# EAGLE design DMX_isolated_V2_single-sided (EAGLE 6.4)
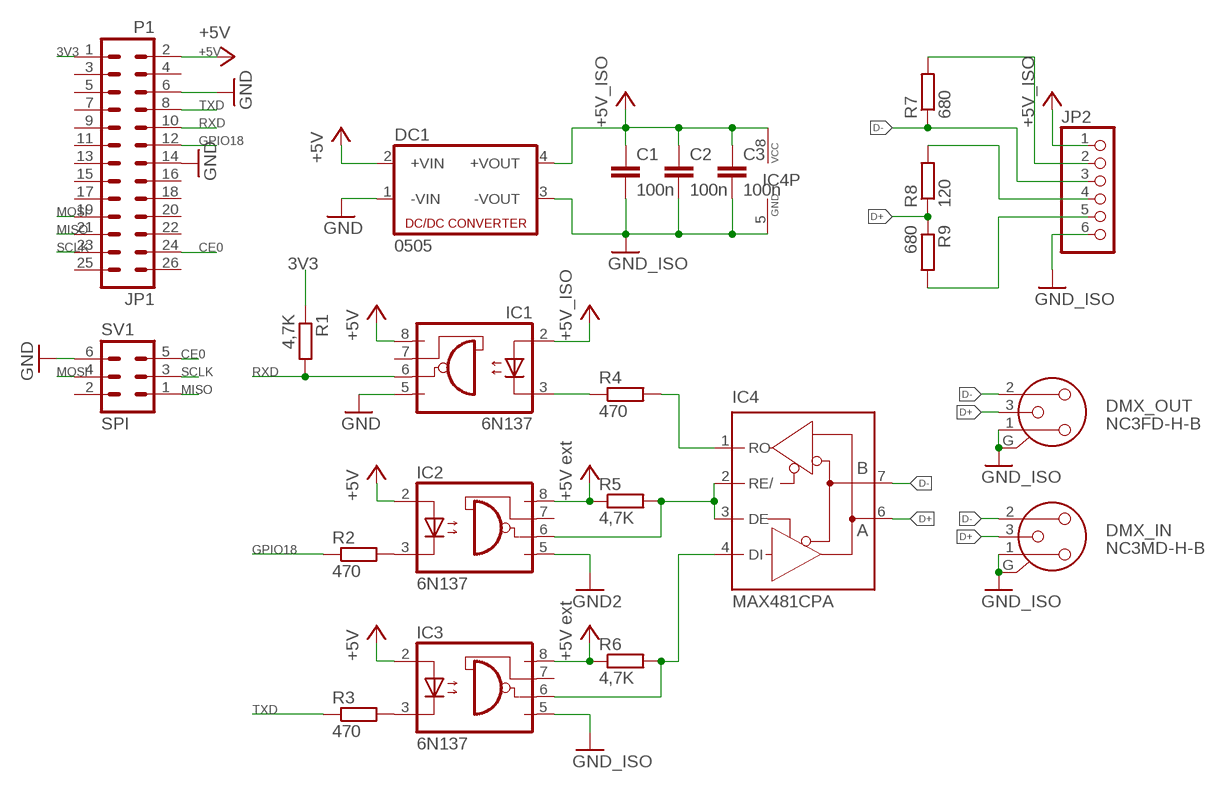
[diagram p0: schematic, sheet 1]

## Parts
C1  100n  C-EU050-024X044  [C050-024X044]
C2  100n  C-EU050-024X044  [C050-024X044]
C3  100n  C-EU050-024X044  [C050-024X044]
DC1  0505  NME  [NME]
DMX_IN  NC3MD-H-B  [NC3MD-H-B]
DMX_OUT  NC3FD-H-B  [NC3FD-H-B]
IC1  6N137  [DIL08]
IC2  6N137  [DIL08]
IC3  6N137  [DIL08]
IC4  MAX481CPA  [DIL08]
JP1  P1  MA13-2  [MA13-2]
JP2  PINHD-1X6  [1X06]
R1  4,7K  R-EU_0204/2V  [0204V]
R2  470  R-EU_0204/2V  [0204V]
R3  470  R-EU_0204/2V  [0204V]
R4  470  R-EU_0204/2V  [0204V]
R5  4,7K  R-EU_0204/2V  [0204V]
R6  4,7K  R-EU_0204/2V  [0204V]
R7  680  R-EU_0204/2V  [0204V]
R8  120  R-EU_0204/2V  [0204V]
R9  680  R-EU_0204/2V  [0204V]
SV1  SPI  MA03-2  [MA03-2]

## Nets
3V3: JP1.1 R1.1
+5V: DC1.2(+VIN) IC1.8(VCC) IC2.2(A) IC3.2(A) JP1.2
+5V_ISO: C1.1 C2.1 C3.1 DC1.4(+VOUT) IC1.2(A) IC2.8(VCC) IC3.8(VCC) IC4.8(VCC) JP2.1 R5.1 R6.1 ; supply symbol labelled +5V ext
CE0: JP1.24 SV1.5
D+: DMX_IN.3 DMX_OUT.3 IC4.6(A) R8.1 R9.1
D-: DMX_IN.2 DMX_OUT.2 IC4.7(B) JP2.3 R7.1
GND: DC1.1(-VIN) IC1.5(GND) JP1.6 JP1.14 SV1.6
GND_ISO: C1.2 C2.2 C3.2 DC1.3(-VOUT) DMX_IN.1 DMX_IN.G DMX_OUT.1 DMX_OUT.G IC2.5(GND) IC3.5(GND) IC4.5(GND) JP2.6 ; supply symbol labelled GND2
GPIO18: JP1.12 R2.1
MISO: JP1.21 SV1.1
MOSI: JP1.19 SV1.4
N$2: JP2.5 R9.2
N$3: IC2.3(C) R2.2
N$4: IC2.6(VO) IC4.2(RE/) IC4.3(DE) R5.2
N$5: IC3.3(C) R3.2
N$7: IC3.6(VO) IC4.4(DI) R6.2
N$8: IC1.3(C) R4.1
N$9: IC4.1(RO) R4.2
N$10: JP2.4 R8.2
N$12: JP2.2 R7.2
RXD: IC1.6(VO) JP1.10 R1.2
SCLK: JP1.23 SV1.3
TXD: JP1.8 R3.1
Unconnected: IC1.7(VE) IC2.7(VE) IC3.7(VE) JP1.3 JP1.4 JP1.5 JP1.7 JP1.9 JP1.11 JP1.13 JP1.15 JP1.16 JP1.17 JP1.18 JP1.20 JP1.22 JP1.25 JP1.26 SV1.2

## Library data of the parts
C1-C3 = rcl:C-EU: CAPACITOR, European symbol
DC1 = dc-dc-converter:NME: DC-DC CONVERTER; MF: C & D TECHNOLOGIES, INC; MPN: NME1205D; OC_FARNELL: 1021466; OC_NEWARK: 98B8198
DMX_IN = con-neutrik_ag:NC3: Neutrik Audio Connector XLR SERIES Stereo 1/4" jack Source: www.neutrik.com/; MPN: NC3MD-H-B; OC_FARNELL: unknown; OC_NEWARK: 27B4298
DMX_OUT = con-neutrik_ag:NC3: Neutrik Audio Connector XLR SERIES Stereo 1/4" jack Source: www.neutrik.com/; MPN: NC3FD-H-B; OC_FARNELL: unknown; OC_NEWARK: 27B4248
IC1-IC3 = optocoupler:6N137: MOTOROLA OPTO COUPLER; MPN: 6N137; OC_FARNELL: 1328376; OC_NEWARK: 52M1895
IC4 = maxim:MAX481CPA: RS485 TRANSEIVER; MPN: MAX481CPA+; OC_FARNELL: unknown; OC_NEWARK: 99K3445
JP1 = con-lstb:MA13-2: PIN HEADER; OC_FARNELL: unknown; OC_NEWARK: unknown
JP2 = pinhead:PINHD-1X6: PIN HEADER
R1-R9 = resistor:R-EU_: RESISTOR, European symbol
SV1 = con-lstb:MA03-2: PIN HEADER; OC_FARNELL: unknown; OC_NEWARK: unknown

## Net classes
1 power: width 0.508 mm

## Board
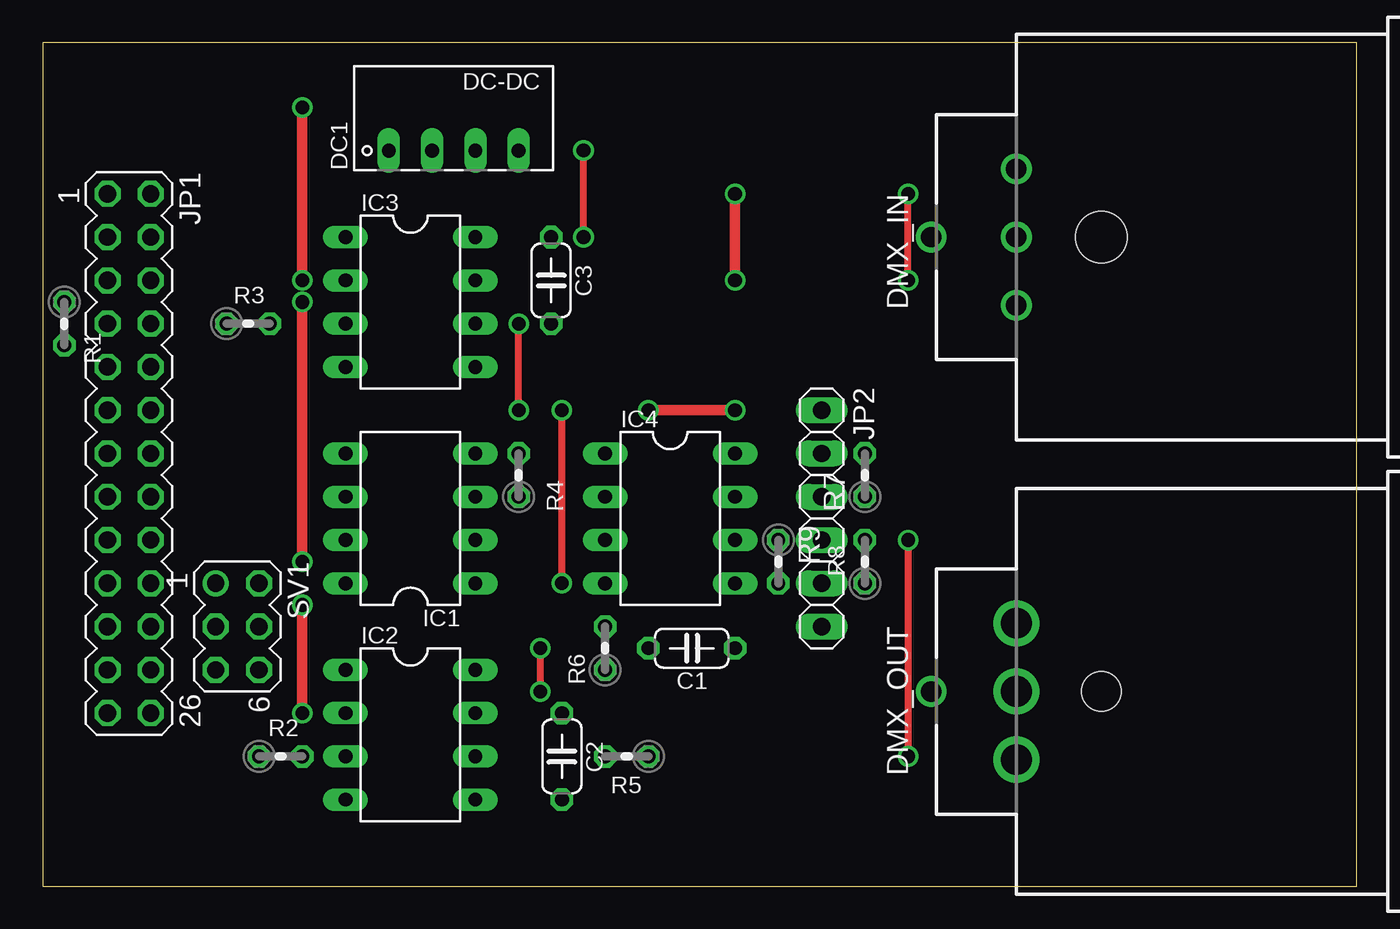
[diagram p1: board, top side]
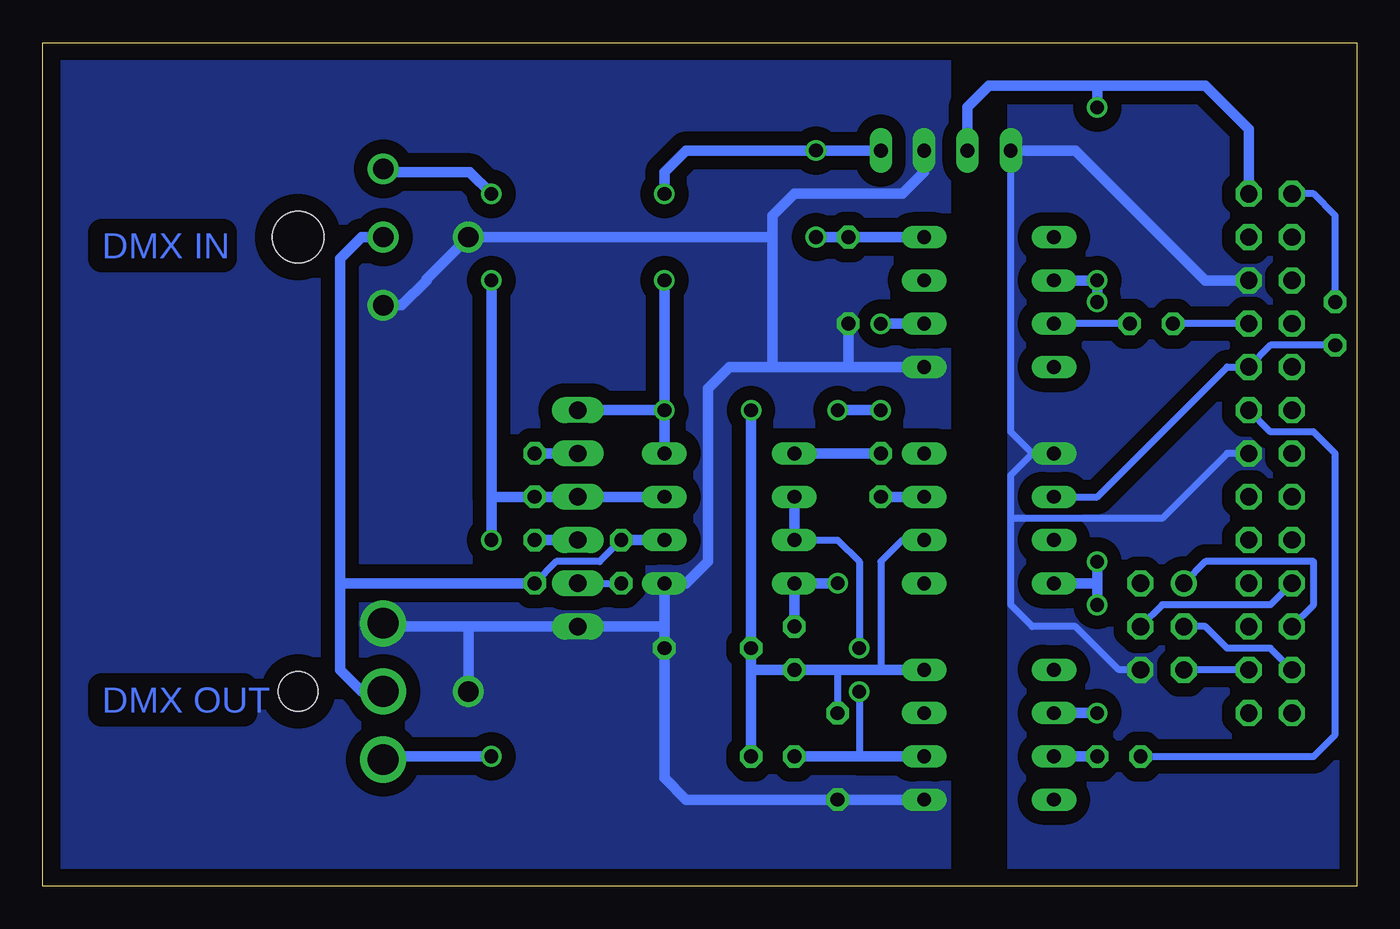
[diagram p2: board, bottom side, seen from below]

Size 77.14 x 49.52 mm. Coordinates in mm from the lower left corner, seen from the top.
Outline: 0,0 77.14,0 77.14,49.52 0,49.52 0,0
Copper layers (1*16): Top 0.035mm / dielectric 1.5mm / Bottom 0.035mm
Design rules "default": minimum track width 10mil, minimum drill 24mil, track to track 8mil, track to pad 8mil, pad to pad 8mil, via to via 8mil, smd to smd 8mil, copper to edge 40mil, drill to drill 8mil, minimum pad ring 10mil, minimum via ring 8mil, stop-mask expansion 4mil, vias tented up to drill 0mil, thermal gap 10mil

### Footprints (pad centres in the part's own frame; a part is rotated, then mirrored left to right if it is on the bottom)
C050-024X044 = drill 0.813 octagon: 1 -2.54,0; 2 2.54,0
NME = drill 0.813 long: 1 0,3.81; 2 0,1.27; 3 0,-1.27; 4 0,-3.81
NC3MD-H-B = drill 1.2: 1 4,0; 2 -4,0; 3 0,0; G 0,-5 | hole 3: 0,5
NC3FD-H-B = drill 1.8: 1 -4,0; 2 4,0; 3 0,0 | drill 1.2: G 0,-5 | hole 2.3: 0,5
DIL08 = drill 0.813 long: 1 -3.81,-3.81; 2 -1.27,-3.81; 3 1.27,-3.81; 4 3.81,-3.81; 5 3.81,3.81; 6 1.27,3.81; 7 -1.27,3.81; 8 -3.81,3.81
MA13-2 = drill 1.016 octagon: 1 -15.24,-1.27; 2 -15.24,1.27; 3 -12.7,-1.27; 4 -12.7,1.27; 5 -10.16,-1.27; 6 -10.16,1.27; 7 -7.62,-1.27; 8 -7.62,1.27; 9 -5.08,-1.27; 10 -5.08,1.27; 11 -2.54,-1.27; 12 -2.54,1.27; 13 0,-1.27; 14 0,1.27; 15 2.54,-1.27; 16 2.54,1.27; 17 5.08,-1.27; 18 5.08,1.27; 19 7.62,-1.27; 20 7.62,1.27; 21 10.16,-1.27; 22 10.16,1.27; 23 12.7,-1.27; 24 12.7,1.27; 25 15.24,-1.27; 26 15.24,1.27
1X06 = drill 1.016 long: 1 -6.35,0; 2 -3.81,0; 3 -1.27,0; 4 1.27,0; 5 3.81,0; 6 6.35,0
0204V = drill 0.813 octagon: 1 -1.27,0; 2 1.27,0
MA03-2 = drill 1.016: 1 -2.54,-1.27 | drill 1.016 octagon: 2 -2.54,1.27; 3 0,-1.27; 4 0,1.27; 5 2.54,-1.27; 6 2.54,1.27

### Placement (x,y rotation side)
C1  38.1,13.97 0 top
C2  30.48,7.62 270 top
C3  29.84,35.56 270 top
DC1  24.13,43.18 90 top
DMX_IN  57.15,38.1 270 top
DMX_OUT  57.15,11.43 270 top
IC1  21.59,21.59 90 top
IC2  21.59,8.89 270 top
IC3  21.59,34.29 270 top
IC4  36.83,21.59 270 top
JP1  5.08,25.4 270 top
JP2  45.72,21.59 270 top
R1  1.27,33.02 270 top
R2  13.97,7.62 0 top
R3  12.07,33.02 0 top
R4  27.94,24.13 90 top
R5  34.29,7.62 180 top
R6  33.02,13.97 90 top
R7  48.26,24.13 90 top
R8  48.26,19.05 90 top
R9  43.18,19.05 270 top
SV1  11.43,15.24 270 top

### Tracks (layer width: path | path; a pad name or v marks a point on that pad's centre or on a via)
3V3
  Bottom 0.406: R1.1 1.27,39.37 2.54,40.64 JP1.1
+5V  (via drill 0.8)
  Top 0.61: v15.24,35.56 v15.24,45.72 | v15.24,34.29 v15.24,19.05 | v15.24,16.51 v15.24,10.16
  Bottom 0.61: JP1.2 6.35,44.45 8.89,46.99 15.24,46.99 | 15.24,46.99 21.59,46.99 22.86,45.72 DC1.2 | v15.24,45.72 15.24,46.99 | IC3.2 v15.24,35.56 v15.24,34.29 | v15.24,19.05 15.24,17.78 | IC1.8 15.24,17.78 | 15.24,17.78 v15.24,16.51 | v15.24,10.16 IC2.2
+5V_ISO  (via drill 0.8)
  Top 0.406: v31.75,38.1 v31.75,43.18
  Top 0.61: v40.64,40.64 v40.64,35.56 | v35.56,27.94 v40.64,27.94
  Bottom 0.406: 30.48,12.7 C2.1 | IC1.2 26.67,20.32 27.94,19.05 27.94,12.7
  Bottom 0.61: IC3.8 C3.1 v31.75,38.1 | v40.64,35.56 v40.64,27.94 | v40.64,27.94 IC4.8 | DC1.4 v31.75,43.18 39.37,43.18 40.64,41.91 v40.64,40.64 | IC2.8 27.94,12.7 30.48,12.7 R6.1 35.56,12.7 | R5.1 35.56,12.7 | 35.56,12.7 C1.1 v35.56,27.94 | v40.64,27.94 JP2.1
CE0
  Bottom 0.406: JP1.24 SV1.5
D+
  Bottom 0.406: DMX_OUT.3 58.42,11.43 | R9.1 44.45,19.05 46.99,19.05 R8.1
  Bottom 0.61: IC4.6 R9.1 | 59.69,17.78 59.69,12.7 58.42,11.43 | 59.69,17.78 59.69,36.83 58.42,38.1 DMX_IN.3 | R8.1 59.69,17.78
D-  (via drill 0.8)
  Top 0.406: v50.8,35.56 v50.8,40.64 | v50.8,20.32 v50.8,7.62
  Bottom 0.406: 56.96,41.91 DMX_IN.2 | 56.96,7.62 DMX_OUT.2
  Bottom 0.61: IC4.7 JP2.3 R7.1 50.8,22.86 | 50.8,22.86 v50.8,35.56 | v50.8,40.64 52.07,41.91 56.96,41.91 | 50.8,22.86 v50.8,20.32 | v50.8,7.62 56.96,7.62
GND
  Bottom 0.406: IC1.5 19.05,25.4 | 19.05,25.4 20.32,26.67 DC1.1 | SV1.6 13.97,12.7 16.51,15.24 19.05,15.24 20.32,16.51 20.32,21.59 | 20.32,21.59 20.32,24.13 19.05,25.4 | JP1.14 7.62,25.4 11.43,21.59 20.32,21.59
  Bottom 0.61: JP1.6 8.89,35.56 16.51,43.18 DC1.1
  pour Bottom (isolate 0.813, no thermals): 20.32,49.53 0,49.53 0,0 20.32,0
GND_ISO
  Bottom 0.406: 54.61,35.56 54.61,35.64 | 56.96,15.24 DMX_OUT.1 | 52.15,15.16 52.07,15.24
  Bottom 0.61: 40.64,15.24 C1.2 40.64,6.35 39.37,5.08 C2.2 IC2.5 | 40.64,15.24 IC4.5 39.37,17.78 38.1,19.05 38.1,29.21 36.83,30.48 34.29,30.48 | 34.29,30.48 29.84,30.48 | 29.84,30.48 IC3.5 | C3.2 29.84,30.48 | DC1.3 25.4,41.91 26.67,40.64 33.02,40.64 34.29,39.37 34.29,38.1 | 34.29,38.1 34.29,30.48 | 34.29,38.1 DMX_IN.G 54.61,35.64 | 40.64,15.24 JP2.6 52.07,15.24 56.96,15.24 | DMX_IN.1 56.07,34.1 54.61,35.56 | DMX_OUT.G 52.15,15.16
  pour Bottom (isolate 0.813, no thermals): 24.13,49.53 76.2,49.53 76.2,0 24.13,0
GPIO18
  Bottom 0.406: R2.1 2.54,7.62 1.27,8.89 1.27,25.4 2.54,26.67 5.08,26.67 JP1.12
MISO
  Bottom 0.406: JP1.21 2.54,16.51 2.54,19.05 8.89,19.05 SV1.1
MOSI
  Bottom 0.406: JP1.19 5.08,16.51 11.43,16.51 SV1.4
N$2
  Bottom 0.406: JP2.5 R9.2
N$3
  Bottom 0.61: IC2.3 R2.2
N$4  (via drill 0.8)
  Top 0.406: v29.21,13.97 v29.21,11.43
  Bottom 0.406: IC4.3 30.48,20.32 29.21,19.05 v29.21,13.97 | v29.21,11.43 29.21,7.62
  Bottom 0.61: IC4.2 IC4.3 | IC2.6 29.21,7.62 R5.2
N$5
  Bottom 0.406: R3.2 IC3.3
N$7  (via drill 0.8)
  Top 0.406: v30.48,17.78 v30.48,27.94 | v27.94,27.94 v27.94,33.02
  Bottom 0.61: R6.2 IC4.4 v30.48,17.78 | v30.48,27.94 v27.94,27.94 | v27.94,33.02 IC3.6
N$8
  Bottom 0.61: IC1.3 R4.1
N$9
  Bottom 0.61: R4.2 IC4.1
N$10
  Bottom 0.61: JP2.4 R8.2
N$12
  Bottom 0.61: JP2.2 R7.2
RXD
  Bottom 0.406: R1.2 5.08,31.75 JP1.10 7.62,30.48 15.24,22.86 IC1.6
SCLK
  Bottom 0.406: JP1.23 5.08,13.97 7.62,13.97 8.89,15.24 SV1.3
TXD
  Bottom 0.406: JP1.8 R3.1

### Text on the board
Bottom: DMX IN | DMX OUT